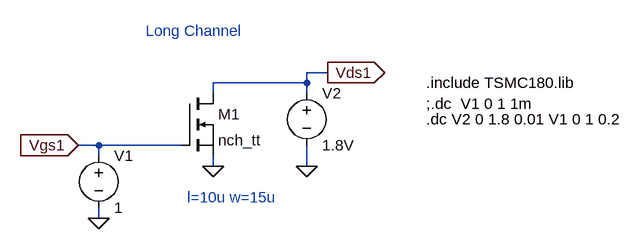
[diagram p0: schematic Prob_4b2.asc]
Prob_4b2.asc, the LTspice schematic file:
Version 4
SHEET 1 948 680
WIRE 192 64 160 64
WIRE 160 80 160 64
WIRE 160 80 16 80
WIRE 16 96 16 80
WIRE 160 96 160 80
WIRE -160 176 -192 176
WIRE -32 176 -160 176
WIRE -160 192 -160 176
WIRE 16 208 16 192
WIRE 160 208 160 176
WIRE -160 288 -160 272
FLAG -160 288 0
FLAG 16 208 0
FLAG 160 208 0
FLAG -192 176 Vgs1
IOPIN -192 176 In
FLAG 192 64 Vds1
IOPIN 192 64 Out
SYMBOL nmos -32 96 R0
SYMATTR InstName M1
SYMATTR Value nch_tt
SYMATTR Value2 l=10u w=15u
SYMBOL voltage -160 176 R0
WINDOW 123 0 0 Left 0
WINDOW 39 0 0 Left 0
SYMATTR InstName V1
SYMATTR Value 1
SYMBOL voltage 160 80 R0
WINDOW 123 0 0 Left 0
WINDOW 39 0 0 Left 0
SYMATTR InstName V2
SYMATTR Value 1.8V
TEXT 344 80 Left 2 !.include TSMC180.lib
TEXT 344 136 Left 2 !.dc V2 0 1.8 0.01 V1 0 1 0.2
TEXT 344 112 Left 2 !;.dc  V1 0 1 1m
TEXT -88 0 Left 2 ;Long Channel
TEXT -24 256 Left 2 ;l=10u w=15u

The netlist it stands for:
* Prob_4b2.asc
M1 Vds1 Vgs1 0 0 nch_tt l=10u w=15u
V1 Vgs1 0 1
V2 Vds1 0 1.8V
.model NMOS NMOS
.model PMOS PMOS
.lib standard.mos
.include TSMC180.lib
.dc V2 0 1.8 0.01 V1 0 1 0.2
;.dc  V1 0 1 1m
* Long Channel
* l=10u w=15u
.backanno
.end